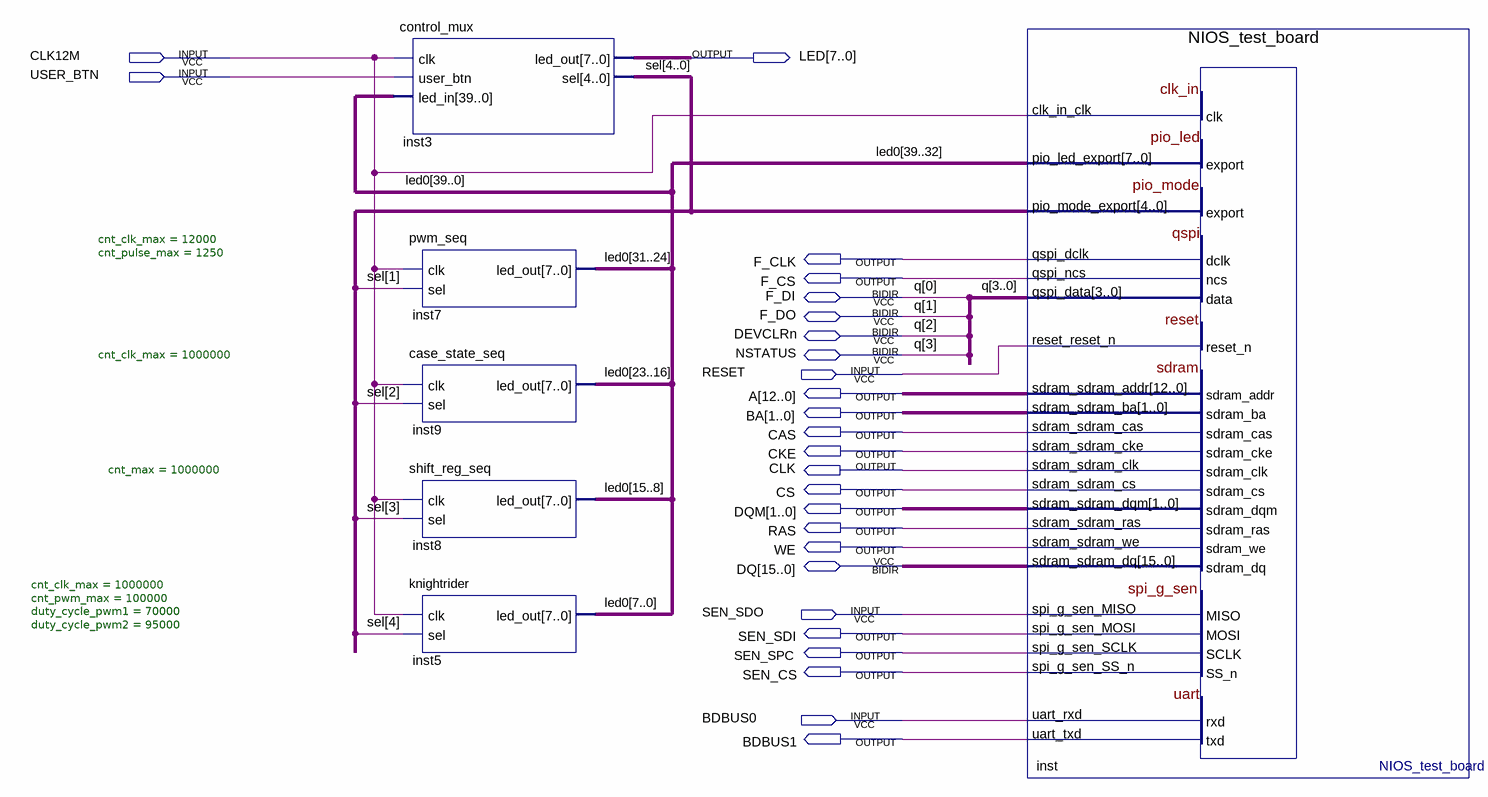
[diagram p0: schematic sheet]
// Quartus schematic test_board.bdf as structural Verilog: 6 symbols, 26 pins
module test_board (
  input  CLK12M,
  input  USER_BTN,
  input  RESET,
  input  SEN_SDO,
  input  BDBUS0,
  inout  F_DI,
  inout  F_DO,
  inout  DEVCLRn,
  inout  NSTATUS,
  inout  [15:0] DQ,
  output [7:0] LED,
  output F_CLK,
  output F_CS,
  output [12:0] A,
  output [1:0] BA,
  output CAS,
  output CKE,
  output CLK,
  output CS,
  output [1:0] DQM,
  output RAS,
  output WE,
  output SEN_SDI,
  output SEN_SPC,
  output SEN_CS,
  output BDBUS1
);

  wire [4:0] sel;
  wire [39:0] led0;

  control_mux inst3 (.clk(CLK12M), .user_btn(USER_BTN), .led_in(led0), .led_out(LED), .sel(sel));
  pwm_seq #(.cnt_clk_max(12000), .cnt_pulse_max(1250)) inst7 (.clk(CLK12M), .sel(sel[1]), .led_out(led0[31:24]));
  case_state_seq #(.cnt_clk_max(1000000)) inst9 (.clk(CLK12M), .sel(sel[2]), .led_out(led0[23:16]));
  shift_reg_seq #(.cnt_max(1000000)) inst8 (.clk(CLK12M), .sel(sel[3]), .led_out(led0[15:8]));
  knightrider #(.cnt_clk_max(1000000), .cnt_pwm_max(100000), .duty_cycle_pwm1(70000), .duty_cycle_pwm2(95000)) inst5 (
    .clk(CLK12M), .sel(sel[4]), .led_out(led0[7:0]));
  NIOS_test_board inst (
    .clk_in_clk(CLK12M), .pio_mode_export(sel), .reset_reset_n(RESET), .spi_g_sen_MISO(SEN_SDO),
    .uart_rxd(BDBUS0), .pio_led_export(led0[39:32]), .qspi_dclk(F_CLK), .qspi_ncs(F_CS),
    .sdram_sdram_addr(A), .sdram_sdram_ba(BA), .sdram_sdram_cas(CAS), .sdram_sdram_cke(CKE),
    .sdram_sdram_clk(CLK), .sdram_sdram_cs(CS), .sdram_sdram_dqm(DQM), .sdram_sdram_ras(RAS),
    .sdram_sdram_we(WE), .spi_g_sen_MOSI(SEN_SDI), .spi_g_sen_SCLK(SEN_SPC), .spi_g_sen_SS_n(SEN_CS),
    .uart_txd(BDBUS1), .qspi_data({NSTATUS, DEVCLRn, F_DO, F_DI}), .sdram_sdram_dq(DQ));

  // Other names for the same wires on the sheet: q[3:0] = {NSTATUS, DEVCLRn, F_DO, F_DI}
endmodule
